# Altium project Placa brazo Robotico.PrjPcb
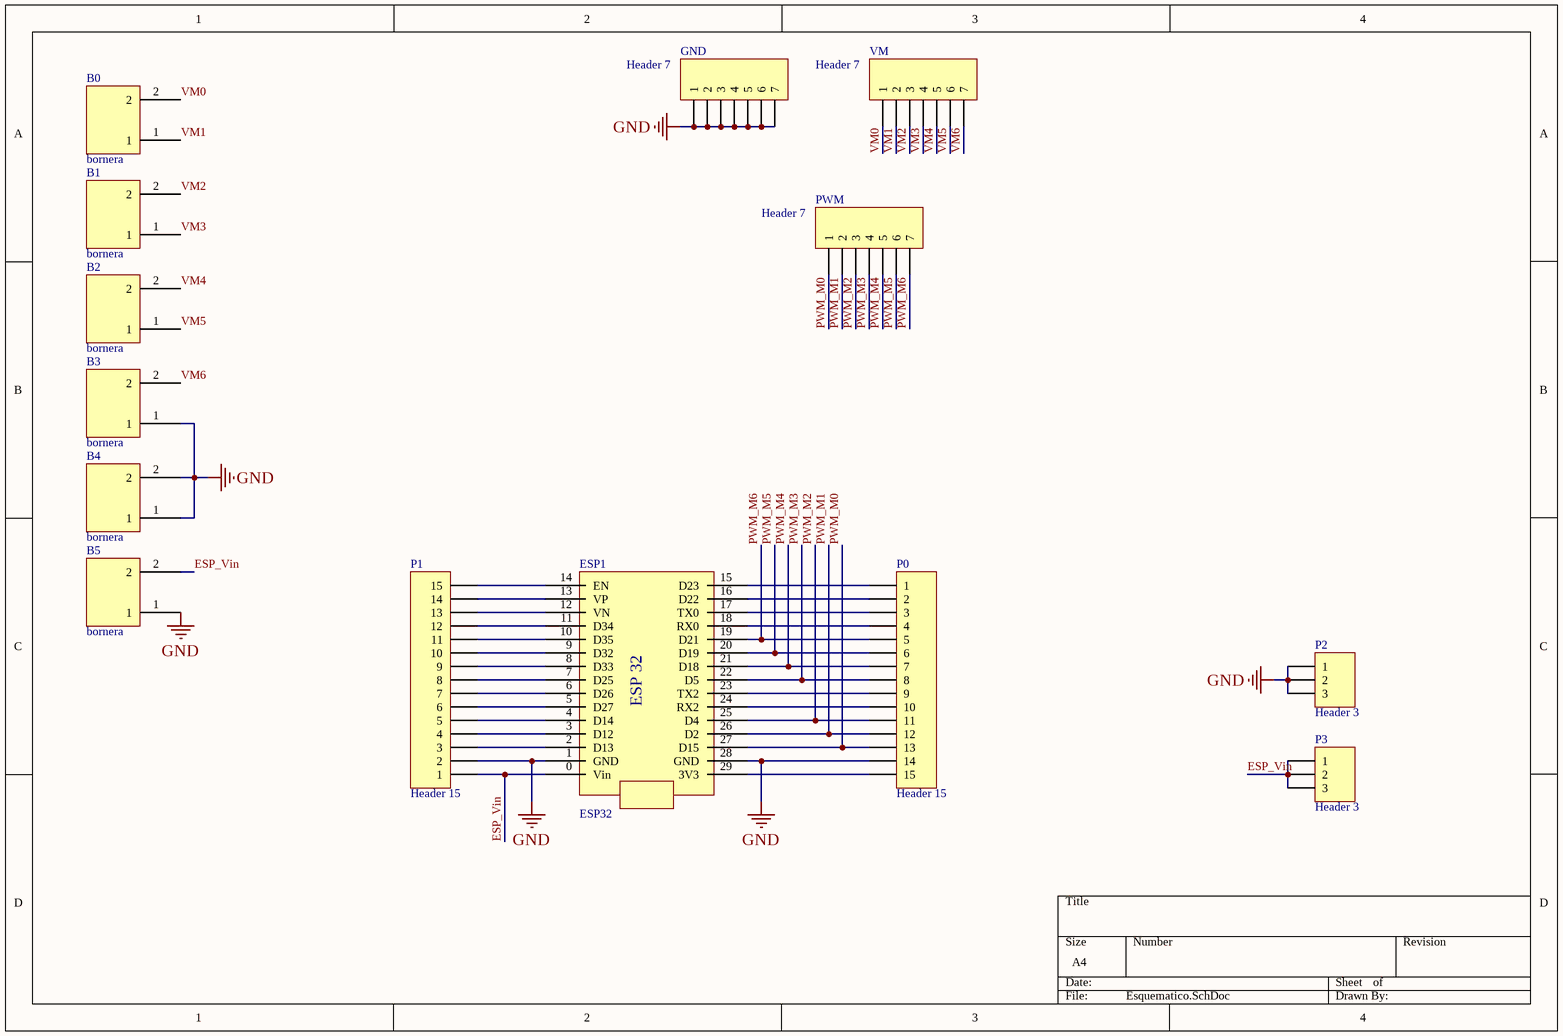
[diagram p0: Esquematico.SchDoc]
2 sheets, 32 parts. Net scope: global (net labels, ports and power ports of the same name join across sheets).
Board file: PCB1.PcbDoc
Sheets:
  Esquematico.SchDoc
  Sheet1.SchDoc

## Sheet Esquematico.SchDoc
size A4

### Parts
B0  bornera  [bornera chica]
B1  bornera  [bornera chica]
B2  bornera  [bornera chica]
B3  bornera  [bornera chica]
B4  bornera  [bornera chica]
B5  bornera  [bornera chica]
ESP1  ESP32  [ESP32]
GND  Header 7  [Header 7]
P0  Header 15  [HDR1X15]
P1  Header 15  [HDR1X15]
P2  Header 3  [Header 3]
P3  Header 3  [Header 3]
PWM  Header 7  [Header 7]
VM  Header 7  [Header 7]

### Nets
GND: B3.1 B4.1 B4.2 B5.1 ESP1.1(GND) ESP1.28(GND) GND.1 GND.2 GND.3 GND.4 GND.5 GND.6 GND.7 P0.14 P1.2 P2.1 P2.2 P2.3
VM0: B0.2 VM.1
VM1: B0.1 VM.2
VM2: B1.2 VM.3
VM3: B1.1 VM.4
VM4: B2.2 VM.5
VM5: B2.1 VM.6
ESP_Vin: B5.2 ESP1.0(Vin) P1.1 P3.1 P3.2 P3.3
PWM_M0: ESP1.27(D15) P0.13 PWM.1
PWM_M1: ESP1.26(D2) P0.12 PWM.2
PWM_M2: ESP1.25(D4) P0.11 PWM.3
PWM_M3: ESP1.22(D5) P0.8 PWM.4
PWM_M4: ESP1.21(D18) P0.7 PWM.5
PWM_M5: ESP1.20(D19) P0.6 PWM.6
PWM_M6: ESP1.19(D21) P0.5 PWM.7
VM6: B3.2 VM.7
NetESP1_2: ESP1.2(D13) P1.3
NetESP1_3: ESP1.3(D12) P1.4
NetESP1_4: ESP1.4(D14) P1.5
NetESP1_5: ESP1.5(D27) P1.6
NetESP1_6: ESP1.6(D26) P1.7
NetESP1_7: ESP1.7(D25) P1.8
NetESP1_8: ESP1.8(D33) P1.9
NetESP1_9: ESP1.9(D32) P1.10
NetESP1_10: ESP1.10(D35) P1.11
NetESP1_11: ESP1.11(D34) P1.12
NetESP1_12: ESP1.12(VN) P1.13
NetESP1_13: ESP1.13(VP) P1.14
NetESP1_14: ESP1.14(EN) P1.15
NetESP1_15: ESP1.15(D23) P0.1
NetESP1_16: ESP1.16(D22) P0.2
NetESP1_17: ESP1.17(TX0) P0.3
NetESP1_18: ESP1.18(RX0) P0.4
NetESP1_23: ESP1.23(TX2) P0.9
NetESP1_24: ESP1.24(RX2) P0.10
NetESP1_29: ESP1.29(3V3) P0.15

### Notes on the sheet
- (in symbol ESP32) ESP 32

### Library data of the parts
GND PWM VM = Header 7: Header, 7-Pin; LatestRevisionDate: 17-Jul-2002; LatestRevisionNote: Re-released for DXP Platform.; Publisher: Altium Limited
P0 P1 = Header 15: Header, 15-Pin; LatestRevisionDate: 17-Jul-2002; LatestRevisionNote: Re-released for DXP Platform.; Publisher: Altium Limited
P2 P3 = Header 3: Header, 3-Pin; LatestRevisionDate: 17-Jul-2002; LatestRevisionNote: Re-released for DXP Platform.; Publisher: Altium Limited

## Sheet Sheet1.SchDoc
size A4
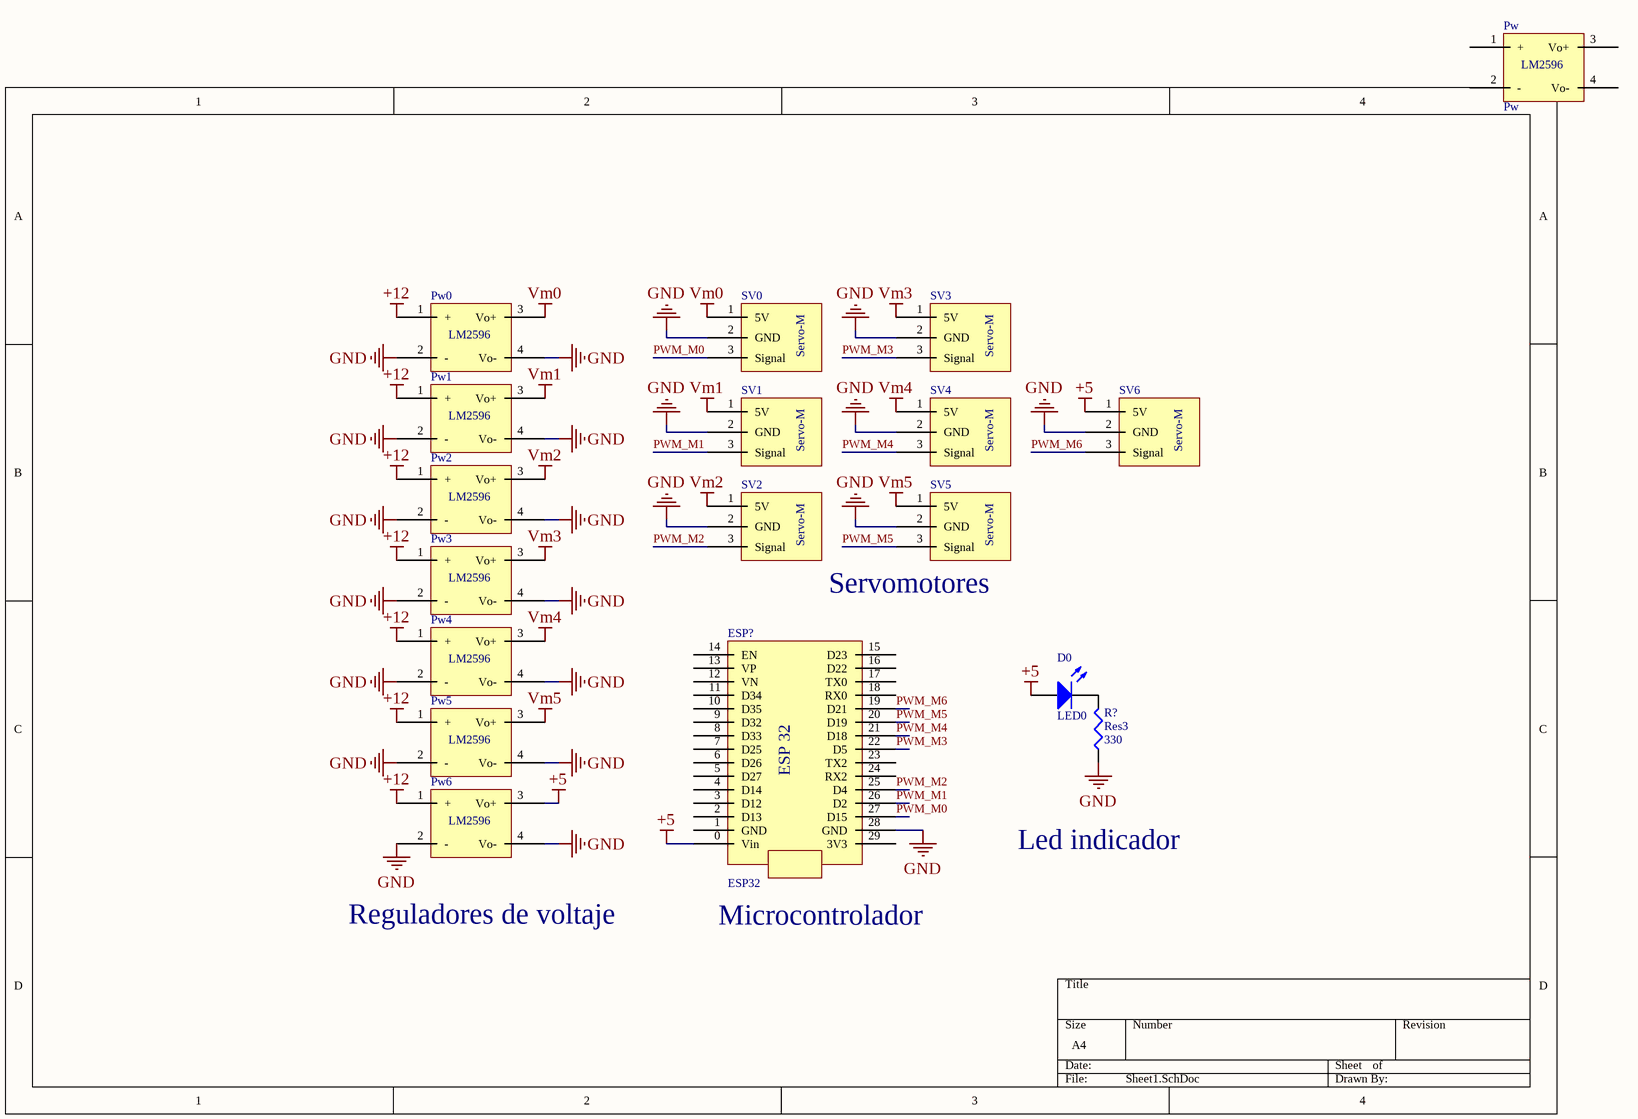
[diagram p1: Sheet1.SchDoc]

### Parts
D0  LED0  [LED-0]
ESP?  ESP32  [ESP32]
Pw  Pw
Pw0  d  (value not drawn)
Pw1  Pw  (value not drawn)
Pw2  Pw  (value not drawn)
Pw3  Pw  (value not drawn)
Pw4  Pw  (value not drawn)
Pw5  Pw  (value not drawn)
Pw6  Pw  (value not drawn)
R?  Res3  value 330  [J1-0603]
SV0  Servo-motor  (value not drawn)
SV1  SERVO-MOTOR  (value not drawn)
SV2  Servo-motor  (value not drawn)
SV3  Servo-motor  (value not drawn)
SV4  Servo-motor  (value not drawn)
SV5  Servo-motor  (value not drawn)
SV6  Servo-motor  (value not drawn)

### Nets
+5: D0.1(A) ESP?.0(Vin) Pw6.3(Vo+) SV6.1(5V)
+12: Pw0.1(+) Pw1.1(+) Pw2.1(+) Pw3.1(+) Pw4.1(+) Pw5.1(+) Pw6.1(+)
GND: ESP?.28(GND) Pw0.2(-) Pw0.4(Vo-) Pw1.2(-) Pw1.4(Vo-) Pw2.2(-) Pw2.4(Vo-) Pw3.2(-) Pw3.4(Vo-) Pw4.2(-) Pw4.4(Vo-) Pw5.2(-) Pw5.4(Vo-) Pw6.2(-) Pw6.4(Vo-) R?.1 SV0.2(GND) SV1.2(GND) SV2.2(GND) SV3.2(GND) SV4.2(GND) SV5.2(GND) SV6.2(GND)
VM0: Pw0.3(Vo+) SV0.1(5V)
VM1: Pw1.3(Vo+) SV1.1(5V)
VM2: Pw2.3(Vo+) SV2.1(5V)
VM3: Pw3.3(Vo+) SV3.1(5V)
VM4: Pw4.3(Vo+) SV4.1(5V)
VM5: Pw5.3(Vo+) SV5.1(5V)
PWM_M0: ESP?.27(D15) SV0.3(Signal)
PWM_M1: ESP?.26(D2) SV1.3(Signal)
PWM_M2: ESP?.25(D4) SV2.3(Signal)
PWM_M3: ESP?.22(D5) SV3.3(Signal)
PWM_M4: ESP?.21(D18) SV4.3(Signal)
PWM_M5: ESP?.20(D19) SV5.3(Signal)
PWM_M6: ESP?.19(D21) SV6.3(Signal)
NetD0_2: D0.2(K) R?.2

Not connected (* = marked no-connect by the designer): ESP? 1(GND) 2(D13) 3(D12) 4(D14) 5(D27) 6(D26) 7(D25) 8(D33) 9(D32) 10(D35) 11(D34) 12(VN) 13(VP) 14(EN) 15(D23) 16(D22) 17(TX0) 18(RX0) 23(TX2) 24(RX2) 29(3V3); Pw 1(+) 2(-) 3(Vo+) 4(Vo-)

### Notes on the sheet
- (near SV5) Servomotores
- Led indicador
- Reguladores de voltaje
- Microcontrolador
- (in symbol ESP32) ESP 32
- (in symbol Pw) LM2596
- (in symbol SERVO-MOTOR) Servo-M

### Library data of the parts
D0 = LED0: Typical INFRARED GaAs LED; Published: 8-Jun-2000; LatestRevisionDate: 08-Jul-2005; LatestRevisionNote: Mech Layer 1 removed.; PackageReference: LED-0; Publisher: Altium Limited; PackageDescription: LED; 2 Leads
Pw0 = Pw
R? = Res3: Resistor; Published: 8-Jun-2000; LatestRevisionDate: 29-May-2009; LatestRevisionNote: IPC-7351 Footprint Added.; PackageReference: J1-0603; Publisher: Altium Limited; PackageDescription: Chip Resistor

## Nets that join several sheets
GND: Esquematico (18 pins), Sheet1 (23 pins)
VM0: Esquematico (B0.2 VM.1), Sheet1 (Pw0.3 SV0.1)
VM1: Esquematico (B0.1 VM.2), Sheet1 (Pw1.3 SV1.1)
VM2: Esquematico (B1.2 VM.3), Sheet1 (Pw2.3 SV2.1)
VM3: Esquematico (B1.1 VM.4), Sheet1 (Pw3.3 SV3.1)
VM4: Esquematico (B2.2 VM.5), Sheet1 (Pw4.3 SV4.1)
VM5: Esquematico (B2.1 VM.6), Sheet1 (Pw5.3 SV5.1)
PWM_M0: Esquematico (ESP1.27 P0.13 PWM.1), Sheet1 (ESP?.27 SV0.3)
PWM_M1: Esquematico (ESP1.26 P0.12 PWM.2), Sheet1 (ESP?.26 SV1.3)
PWM_M2: Esquematico (ESP1.25 P0.11 PWM.3), Sheet1 (ESP?.25 SV2.3)
PWM_M3: Esquematico (ESP1.22 P0.8 PWM.4), Sheet1 (ESP?.22 SV3.3)
PWM_M4: Esquematico (ESP1.21 P0.7 PWM.5), Sheet1 (ESP?.21 SV4.3)
PWM_M5: Esquematico (ESP1.20 P0.6 PWM.6), Sheet1 (ESP?.20 SV5.3)
PWM_M6: Esquematico (ESP1.19 P0.5 PWM.7), Sheet1 (ESP?.19 SV6.3)